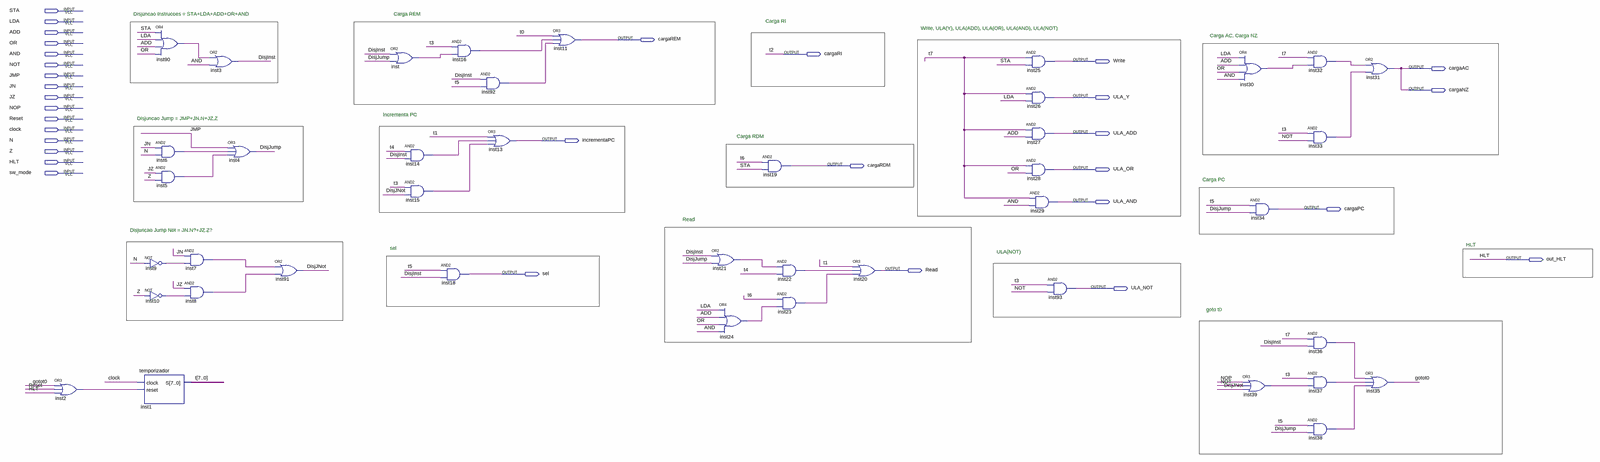
[diagram p0: schematic sheet, whole]
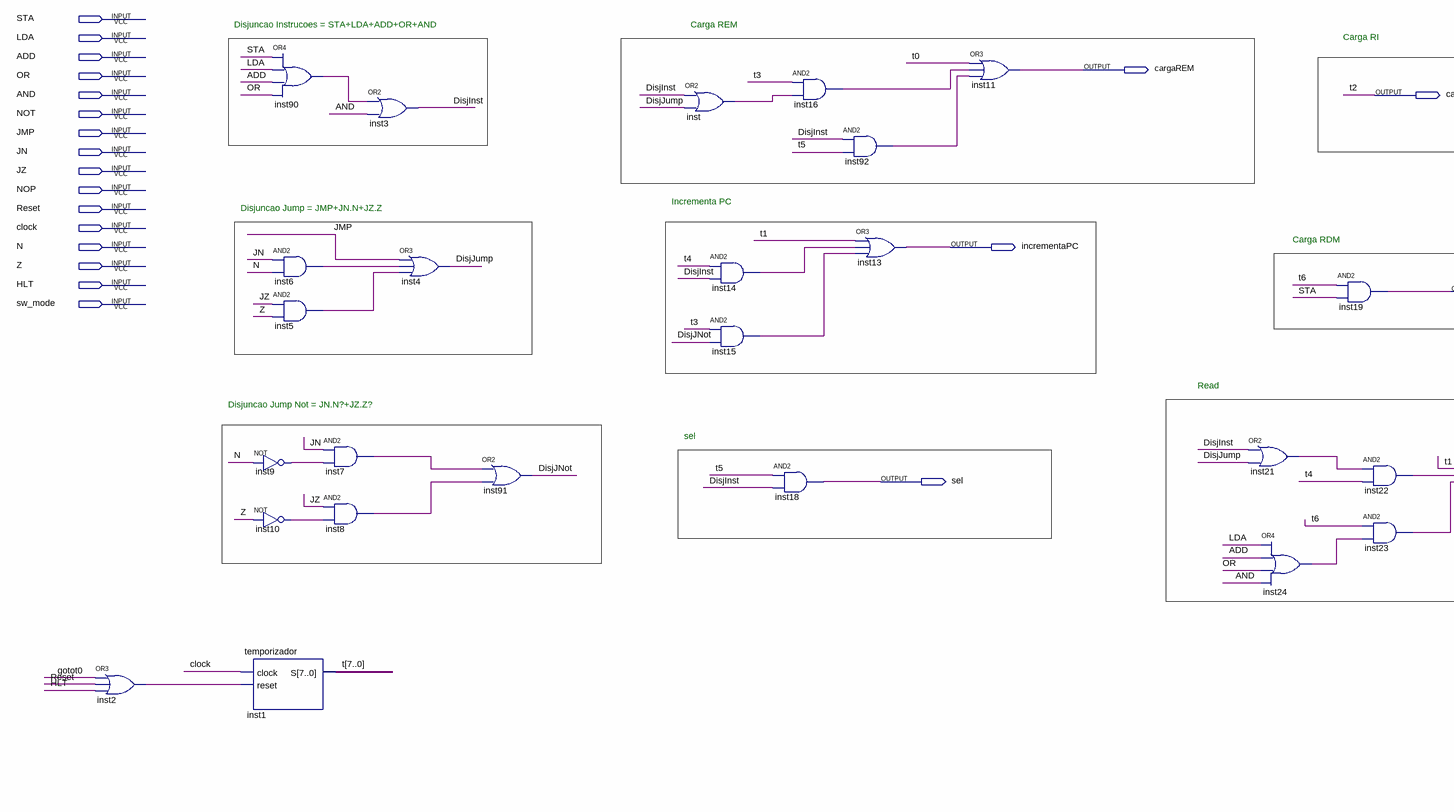
[diagram p1: schematic sheet, left part]
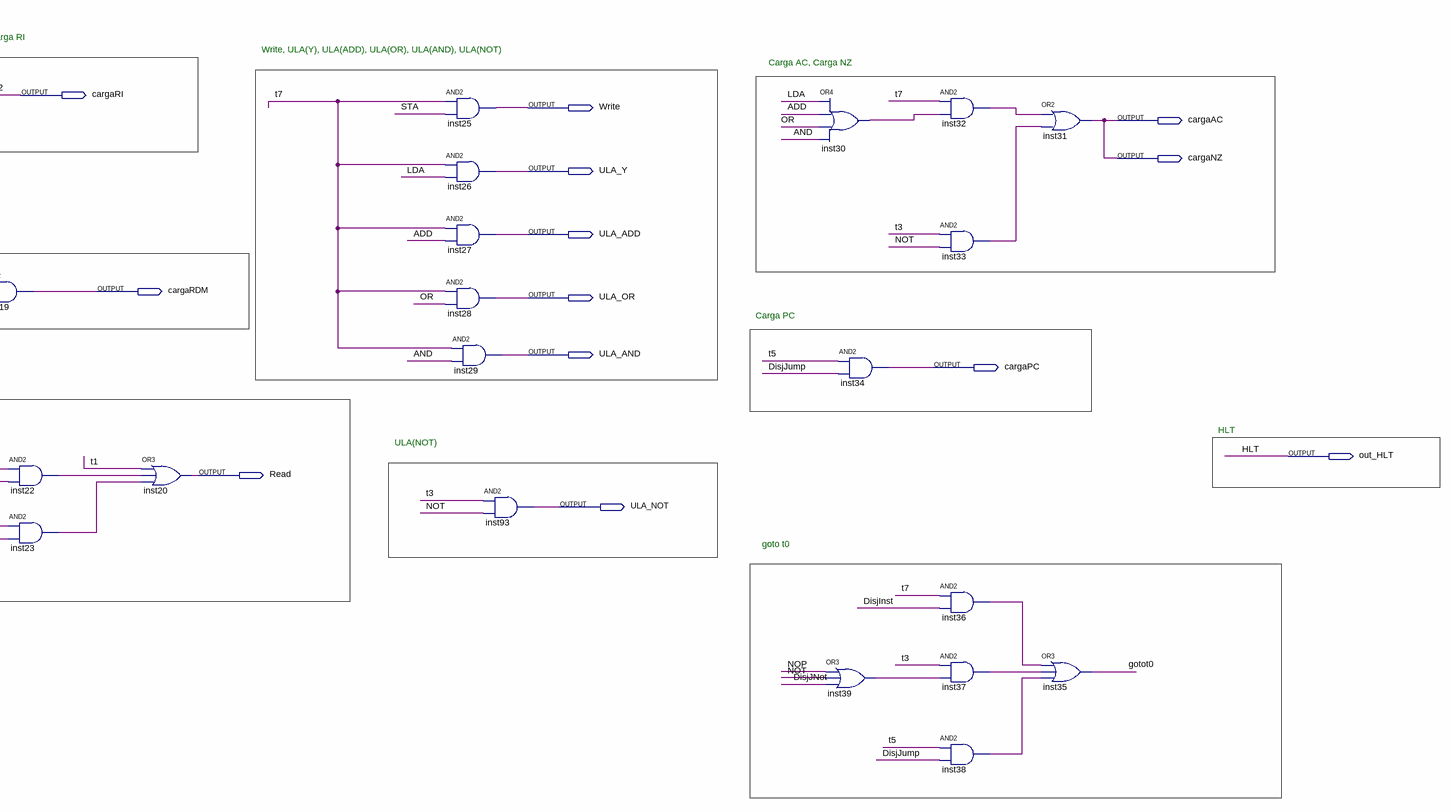
[diagram p2: schematic sheet, right part]
// Quartus schematic unidade_controle.bdf as structural Verilog: 42 symbols, 32 pins
module unidade_controle (
  input  STA,
  input  LDA,
  input  ADD,
  input  OR,
  input  AND,
  input  NOT,
  input  JMP,
  input  JN,
  input  JZ,
  input  NOP,
  input  Reset,
  input  clock,
  input  N,
  input  Z,
  input  HLT,
  input  sw_mode,
  output cargaREM,
  output cargaRI,
  output Write,
  output cargaAC,
  output cargaNZ,
  output ULA_Y,
  output ULA_ADD,
  output incrementaPC,
  output cargaRDM,
  output ULA_OR,
  output ULA_AND,
  output cargaPC,
  output out_HLT,
  output Read,
  output sel,
  output ULA_NOT
);

  wire DisjInst, DisjJNot, DisjJump, gotot0, inst2_out, inst5_out, inst6_out, inst7_out, inst8_out,
       inst9_out, inst10_out, inst14_out, inst15_out, inst16_out, inst21_out, inst22_out, inst23_out,
       inst24_out, inst30_out, inst32_out, inst33_out, inst36_out, inst37_out, inst38_out, inst39_out,
       inst90_out, inst92_out, inst_out;
  wire [7:0] t;

  or inst2 (inst2_out, gotot0, Reset, HLT);
  temporizador inst1 (.clock(clock), .reset(inst2_out), .S({t[7:3], cargaRI, t[1:0]}));
  or inst90 (inst90_out, STA, LDA, ADD, OR);
  and inst6 (inst6_out, JN, N);
  and inst5 (inst5_out, JZ, Z);
  not inst9 (inst9_out, N);
  not inst10 (inst10_out, Z);
  and inst7 (inst7_out, JN, inst9_out);
  and inst8 (inst8_out, JZ, inst10_out);
  or inst3 (DisjInst, inst90_out, AND);
  or inst4 (DisjJump, JMP, inst6_out, inst5_out);
  or inst91 (DisjJNot, inst7_out, inst8_out);
  or inst (inst_out, DisjInst, DisjJump);
  and inst14 (inst14_out, t[4], DisjInst);
  and inst15 (inst15_out, t[3], DisjJNot);
  and inst16 (inst16_out, t[3], inst_out);
  and inst18 (sel, t[5], DisjInst);
  and inst92 (inst92_out, DisjInst, t[5]);
  or inst13 (incrementaPC, t[1], inst14_out, inst15_out);
  or inst11 (cargaREM, t[0], inst16_out, inst92_out);
  or inst21 (inst21_out, DisjInst, DisjJump);
  or inst24 (inst24_out, LDA, ADD, OR, AND);
  and inst19 (cargaRDM, t[6], STA);
  and inst22 (inst22_out, inst21_out, t[4]);
  and inst23 (inst23_out, t[6], inst24_out);
  or inst20 (Read, t[1], inst22_out, inst23_out);
  and inst25 (Write, t[7], STA);
  and inst26 (ULA_Y, t[7], LDA);
  and inst27 (ULA_ADD, t[7], ADD);
  and inst28 (ULA_OR, t[7], OR);
  and inst29 (ULA_AND, t[7], AND);
  and inst93 (ULA_NOT, t[3], NOT);
  or inst30 (inst30_out, LDA, ADD, OR, AND);
  and inst34 (cargaPC, t[5], DisjJump);
  or inst39 (inst39_out, NOP, NOT, DisjJNot);
  and inst32 (inst32_out, t[7], inst30_out);
  and inst33 (inst33_out, t[3], NOT);
  and inst36 (inst36_out, t[7], DisjInst);
  and inst37 (inst37_out, t[3], inst39_out);
  and inst38 (inst38_out, t[5], DisjJump);
  or inst31 (cargaAC, inst32_out, inst33_out);
  or inst35 (gotot0, inst36_out, inst37_out, inst38_out);

  assign cargaNZ = cargaAC;
  assign out_HLT = HLT;

  // Other names for the same wires on the sheet: t[2] = cargaRI; t2 = cargaRI

  // Notes on the sheet:
  //   Disjuncao Instrucoes = STA+LDA+ADD+OR+AND
  //   Carga REM
  //   Carga RI
  //   Write, ULA(Y), ULA(ADD), ULA(OR), ULA(AND), ULA(NOT)
  //   Carga AC, Carga NZ
  //   Incrementa PC
  //   Disjuncao Jump = JMP+JN.N+JZ.Z
  //   Carga RDM
  //   Carga PC
  //   Read
  //   Disjuncao Jump Not = JN.N?+JZ.Z?
  //   HLT
  //   sel
  //   ULA(NOT)
  //   goto t0
endmodule
